# EAGLE design HUD (EAGLE 7.7.0)
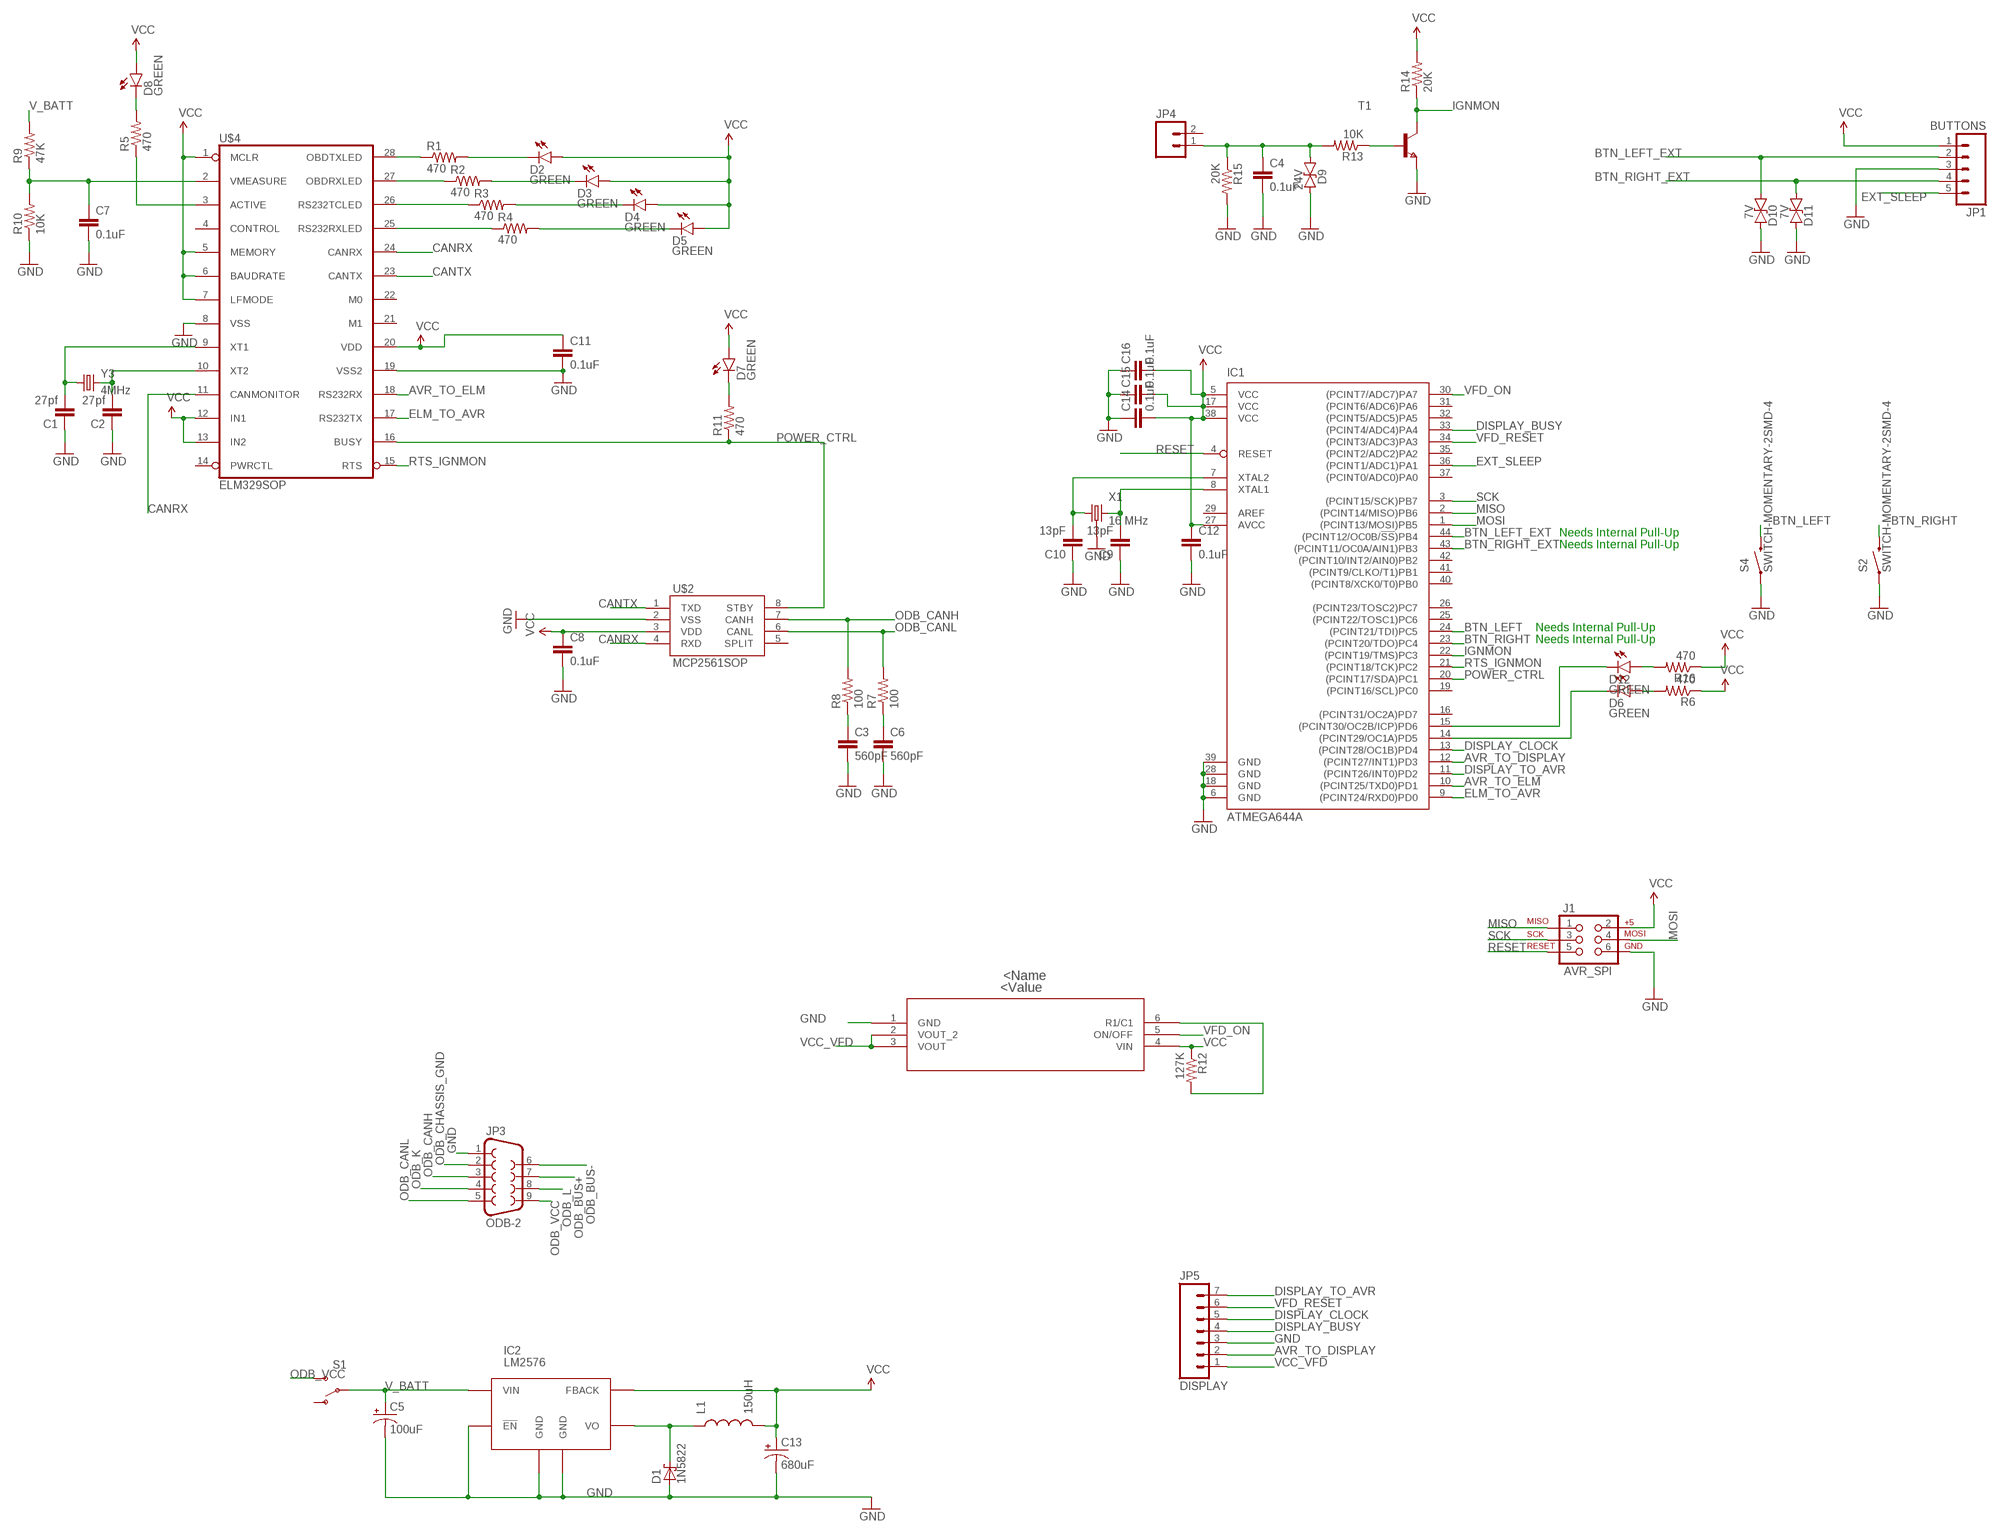
[diagram p0: schematic, sheet 1]

## Parts
C1  27pf  560PF-50V-5%(0603)  [0603-CAP]
C2  27pf  560PF-50V-5%(0603)  [0603-CAP]
C3  560pF  560PF-50V-5%(0603)  [0603-CAP]
C4  0.1uF  560PF-50V-5%(0603)  [0603-CAP]
C5  100uF  CAP_POLPTH1  [CPOL-RADIAL-100UF-25V]
C6  560pF  560PF-50V-5%(0603)  [0603-CAP]
C7  0.1uF  560PF-50V-5%(0603)  [0603-CAP]
C8  0.1uF  560PF-50V-5%(0603)  [0603-CAP]
C9  13pF  560PF-50V-5%(0603)  [0603-CAP]
C10  13pF  560PF-50V-5%(0603)  [0603-CAP]
C11  0.1uF  560PF-50V-5%(0603)  [0603-CAP]
C12  0.1uF  560PF-50V-5%(0603)  [0603-CAP]
C13  680uF  1000UF-25V(PTH)  [CPOL-RADIAL-1000UF-25V]
C14  0.1uF  560PF-50V-5%(0603)  [0603-CAP]
C15  0.1uF  560PF-50V-5%(0603)  [0603-CAP]
C16  0.1uF  560PF-50V-5%(0603)  [0603-CAP]
D1  1N5822  SCHOTTKY-DIODEDO201T15  [DO201T15]
D2  GREEN  LED-GREENLARGE  [LED-1206]
D3  GREEN  LED-GREENLARGE  [LED-1206]
D4  GREEN  LED-GREENLARGE  [LED-1206]
D5  GREEN  LED-GREENLARGE  [LED-1206]
D6  GREEN  LED-GREENLARGE  [LED-1206]
D7  GREEN  LED-GREENLARGE  [LED-1206]
D8  GREEN  LED-GREENLARGE  [LED-1206]
D9  24V  DIODE-TVS16V  [SOD-123]
D10  7V  DIODE-TVS16V  [SOD-123]
D11  7V  DIODE-TVS16V  [SOD-123]
D12  GREEN  LED-GREENLARGE  [LED-1206]
IC1  ATMEGA644A  [TQFP44]
IC2  LM2576  LM2576S  [TO263-5]
J1  AVR_SPI  AVR_SPI_PRG_6PTH  [2X3]
JP1  BUTTONS  M05LOCK  [1X05_LOCK]
JP3  ODB-2  DB9MALE  [DB9_MALE]
JP4  M02LOCK  [1X02_LOCK]
JP5  DISPLAY  M07LOCK  [1X07_LOCK]
L1  150uH  INDUCTORPWR  [CDRH125]
R1  470  RESISTOR0603-RES  [0603-RES]
R2  470  RESISTOR0603-RES  [0603-RES]
R3  470  RESISTOR0603-RES  [0603-RES]
R4  470  RESISTOR0603-RES  [0603-RES]
R5  470  RESISTOR0603-RES  [0603-RES]
R6  470  RESISTOR0603-RES  [0603-RES]
R7  100  RESISTOR0603-RES  [0603-RES]
R8  100  RESISTOR0603-RES  [0603-RES]
R9  47K  RESISTOR0603-RES  [0603-RES]
R10  10K  RESISTOR0603-RES  [0603-RES]
R11  470  RESISTOR0603-RES  [0603-RES]
R12  127K  RESISTOR0603-RES  [0603-RES]
R13  10K  RESISTOR0603-RES  [0603-RES]
R14  20K  RESISTOR0603-RES  [0603-RES]
R15  20K  RESISTOR0603-RES  [0603-RES]
R16  470  RESISTOR0603-RES  [0603-RES]
S1  SWITCH-SPDTPTH  [SWITCH-SPDT]
S2  SWITCH-MOMENTARY-2SMD-4  [TACTILE_SWITCH_TALL]
S4  SWITCH-MOMENTARY-2SMD-4  [TACTILE_SWITCH_TALL]
T1  NPNSOT323  [SOT323]
U$1  TPS27082LDDCRDDC6-M  [DDC6-M]
U$2  MCP2561SOP  [SO08]
U$4  ELM329SOP  [SO28W]
X1  16 MHz  CRYSTAL-GROUNDED3.2X2.5  [CRYSTAL-SMD-3.2X2.5]
Y3  4MHz  CRYSTALHC49US  [HC49US]

## Nets
AVR_TO_DISPLAY: IC1.12((PCINT27/INT1)PD3) JP5.2
AVR_TO_ELM: IC1.10((PCINT25/TXD0)PD1) U$4.18(RS232RX)
BTN_LEFT: IC1.24((PCINT21/TDI)PC5) S4.B2
BTN_LEFT_EXT: D10.A IC1.44((PCINT12/OC0B/!SS!)PB4) JP1.2
BTN_RIGHT: IC1.23((PCINT20/TDO)PC4) S2.B2
BTN_RIGHT_EXT: D11.A IC1.43((PCINT11/OC0A/AIN1)PB3) JP1.4
CANRX: U$2.4(RXD) U$4.11(CANMONITOR) U$4.24(CANRX)
CANTX: U$2.1(TXD) U$4.23(CANTX)
DISPLAY_BUSY: IC1.33((PCINT4/ADC4)PA4) JP5.4
DISPLAY_CLOCK: IC1.13((PCINT28/OC1B)PD4) JP5.5
DISPLAY_TO_AVR: IC1.11((PCINT26/INT0)PD2) JP5.7
ELM_TO_AVR: IC1.9((PCINT24/RXD0)PD0) U$4.17(RS232TX)
EXT_SLEEP: IC1.36((PCINT1/ADC1)PA1) JP1.5
GND [Power]: C1.1 C2.1 C3.2 C4.2 C5.2(-) C6.2 C7.2 C8.2 C9.1 C10.1 C11.2 C12.2 C13.- C14.1 C15.1 C16.1 D1.A D9.C D10.C D11.C IC1.6(GND) IC1.18(GND) IC1.28(GND) IC1.39(GND) IC2.3(GND) IC2.5(!EN) IC2.TAB(GND) J1.6 JP1.3 JP3.1 JP5.3 R10.1 R15.2 S2.A2 S4.A2 T1.3(E) U$1.1(GND) U$2.2(VSS) U$4.8(VSS) U$4.19(VSS2) X1.2 X1.4
IGNMON: IC1.22((PCINT19/TMS)PC3) R14.1 T1.1(C)
MISO: IC1.2((PCINT14/MISO)PB6) J1.1
MOSI: IC1.1((PCINT13/MOSI)PB5) J1.4
N$1 [Power]: R12.2 U$1.6(R1/C1)
N$2: D7.C R11.2
N$3: C4.1 D9.A JP4.1 R13.2 R15.1
N$4: D6.C IC1.14((PCINT29/OC1A)PD5)
N$5: R13.1 T1.2(B)
N$6 [Power]: D1.C IC2.2(VO) L1.1
N$7: R1.1 U$4.28(OBDTXLED)
N$8: D12.A R16.2
N$9: R2.1 U$4.27(OBDRXLED)
N$10: D12.C IC1.15((PCINT30/OC2B/ICP)PD6)
N$11: R3.1 U$4.26(RS232TCLED)
N$14: R4.1 U$4.25(RS232RXLED)
N$15: C1.2 U$4.9(XT1) Y3.1
N$16: C2.2 U$4.10(XT2) Y3.2
N$17: R5.1 U$4.3(ACTIVE)
N$18: D2.C R1.2
N$19: D3.C R2.2
N$20: D4.C R3.2
N$21: D5.C R4.2
N$22: D8.C R5.2
N$26: D6.A R6.2
N$28: C3.1 R8.1
N$29: C6.1 R7.1
N$32: C7.1 R9.1 R10.2 U$4.2(VMEASURE)
N$37: C10.2 IC1.7(XTAL2) X1.3
N$40: C9.2 IC1.8(XTAL1) X1.1
ODB_BUS+: JP3.7
ODB_BUS-: JP3.6
ODB_CANH: JP3.3 R8.2 U$2.7(CANH)
ODB_CANL: JP3.5 R7.2 U$2.6(CANL)
ODB_CHASSIS_GND: JP3.2
ODB_K: JP3.4
ODB_L: JP3.8
ODB_VCC [Power]: JP3.9 S1.3(S)
POWER_CTRL: IC1.20((PCINT17/SDA)PC1) R11.1 U$2.8(STBY) U$4.16(BUSY)
RESET: IC1.4(RESET) J1.5
RTS_IGNMON: IC1.21((PCINT18/TCK)PC2) U$4.15(RTS)
SCK: IC1.3((PCINT15/SCK)PB7) J1.3
V_BATT [Power]: C5.1(+) IC2.1(VIN) R9.2 S1.2(P)
VCC [Power]: C8.1 C11.1 C12.1 C13.+ C14.2 C15.2 C16.2 D2.A D3.A D4.A D5.A D7.A D8.A IC1.5(VCC) IC1.17(VCC) IC1.27(AVCC) IC1.38(VCC) IC2.4(FBACK) J1.2 JP1.1 L1.2 R6.1 R12.1 R14.2 R16.1 U$1.4(VIN) U$2.3(VDD) U$4.1(MCLR) U$4.5(MEMORY) U$4.6(BAUDRATE) U$4.7(LFMODE) U$4.12(IN1) U$4.13(IN2) U$4.20(VDD)
VCC_VFD [Power]: JP5.1 U$1.2(VOUT_2) U$1.3(VOUT)
VFD_ON: IC1.30((PCINT7/ADC7)PA7) U$1.5(ON/OFF)
VFD_RESET: IC1.34((PCINT3/ADC3)PA3) JP5.6
Unconnected: IC1.16((PCINT31/OC2A)PD7) IC1.19((PCINT16/SCL)PC0) IC1.25((PCINT22/TOSC1)PC6) IC1.26((PCINT23/TOSC2)PC7) IC1.29(AREF) IC1.31((PCINT6/ADC6)PA6) IC1.32((PCINT5/ADC5)PA5) IC1.35((PCINT2/ADC2)PA2) IC1.37((PCINT0/ADC0)PA0) IC1.40((PCINT8/XCK0/T0)PB0) IC1.41((PCINT9/CLKO/T1)PB1) IC1.42((PCINT10/INT2/AIN0)PB2) JP4.2 S1.1(O) U$2.5(SPLIT) U$4.4(CONTROL) U$4.14(PWRCTL) U$4.21(M1) U$4.22(M0)

## Notes on the sheet
- Needs Internal Pull-Up
- Needs Internal Pull-Up
- Needs Internal Pull-Up
- Needs Internal Pull-Up

## Library data of the parts
C1 C2 C4 C7-C12 C14-C16 = SparkFun-Capacitors:560PF-50V-5%(0603): CAP-08749; PROD_ID: CAP-08749; VALUE: 560pF
C3 C6 = SparkFun-Capacitors:560PF-50V-5%(0603): CAP-08749; PROD_ID: CAP-08749
C5 = SparkFun-Capacitors:CAP_POL: Capacitor Polarized These are standard SMD and PTH capacitors. Normally 10uF, 47uF, and 100uF in electrolytic and tantalum varieties. Always verify the external diameter of the through hole cap, it varies with capacity, voltage, and manufacturer. The EIA devices should be standard.
C13 = SparkFun-Capacitors:1000UF-25V(PTH): CAP-08070; PROD_ID: CAP-09538; VALUE: CAP-09538
D1 = diode:SCHOTTKY-DIODE: Schottky Diode
D2-D8 D12 = SparkFun-LED:LED-GREEN: Various green LEDs Green LEDs used in SFE Production 0603- DIO-00821 LARGE- DIO-00862 LILYPAD- DIO-09910; PROD_ID: DIO-00862
D9-D11 = analog:DIODE-TVS: Zener Diode Production Part - 8199 3.4V Zener Voltage; PROD_ID: DIO-12440; VALUE: 16V
IC1 = atmel:ATMEGA644: 8-bit Microcontroller with 64K Bytes In-System Programmable Flash Source: http://www.atmel.com/dyn/resources/prod_documents/doc2593.pdf; MPN: ATMEGA644PV-10AU; OC_FARNELL: 1455123; OC_NEWARK: 58M3748
IC2 = AWJLEagleLib:LM2576: Texas Instruments LM2576 Simple Switcher
J1 = SparkFun-Connectors:AVR_SPI_PRG_6: AVR ISP 6 Pin This is the reduced ISP connector for AVR programming. Common on Arduino. This footprint will take up less PCB space and can be used with a 10-pin to 6-pin adapter such as SKU: BOB-08508 **Special note about "TEST_POINT" package. The stop mask is on the top side, so if you want your programming test points to be on the bottom of your board, make sure to place this package on the bottom side of the board. This also ensure that the orientation to program from the bottom side will be correct.
JP1 = SparkFun-Connectors:M05: Header 5 Standard 5-pin 0.1" header. Use with straight break away headers (SKU : PRT-00116), right angle break away headers (PRT-00553), swiss pins (PRT-00743), machine pins (PRT-00117), and female headers (PRT-00115). Molex polarized connector foot print use with SKU : PRT-08230 with associated crimp pins and housings.
JP3 = SparkFun-Connectors:DB9: DB9 Connector Standard DB9 (D-Sub 9) serial connector. Can be used for CAN bus as well as RS485 and RS232. Footprint production proven. Spark Fun Electronics SKU : PRT-00429; PROD_ID: CONN-09904
JP4 = SparkFun-Connectors:M02: Standard 2-pin 0.1" header. Use with - straight break away headers ( PRT-00116) - right angle break away headers (PRT-00553) - swiss pins (PRT-00743) - machine pins (PRT-00117) - female headers (PRT-00115) Molex polarized connector foot print use with: PRT-08233 with associated crimp pins and housings. 2.54_SCREWTERM for use with PRT-10571. 3.5mm Screw Terminal footprints for PRT-08084 5mm Screw Terminal footprints for use with PRT-08432
JP5 = SparkFun-Connectors:M07: Header 7 Standard 7-pin 0.1" header. Use with straight break away headers (SKU : PRT-00116), right angle break away headers (PRT-00553), swiss pins (PRT-00743), machine pins (PRT-00117), and female headers (PRT-00115). NOTES ON THE VARIANTS LOCK and LOCK_LONGPADS... This footprint was designed to help hold the alignment of a through-hole component (i.e. 7-pin header) while soldering it into place. You may notice that each hole has been shifted either up or down by 0.005 of an inch from it's more standard position (which is usually a perfectly straight line). This slight alteration caused the pins (the squares in the middle) to touch the edges of the holes. Because they are alternating, it causes a "brace" to hold the header in place. 0.005 has proven to be the perfect amount of "off-center" position when using our standard breakaway headers. Although looks a little odd when you look at the bare footprint, once you have a header in there, the alteration is very hard to notice. Also, if you push a header all the way into place, it is covered up entirely on the bottom side. This idea of altering the position of holes to aid alignment will be further integrated into the Sparkfun Library for other footprints. It can help hold any component with 3 or more connection pins.
L1 = SparkFun-Passives:INDUCTOR: Inductors Basic Inductor/Choke - 0603 and 1206. Footprints are not proven and vary greatly between part numbers. SRN6045- 33uH, 20% 1.4A SDR0403-560KL - 56uH, 10%, 500mA RMS/740mA peak
R1-R16 = SparkFun-Passives:RESISTOR: Resistor Basic schematic elements and footprints for 0603, 1206, and PTH resistors.
S1 = SparkFun-Electromechanical:SWITCH-SPDT: SPDT Switch Simple slide switch, Spark Fun Electronics SKU : COM-00102 DPDT SMT slide switch, AYZ0202, SWCH-08179; PROD_ID: SWCH-08261
S2 S4 = SparkFun-Electromechanical:SWITCH-MOMENTARY-2: Various NO switches- pushbuttons, reed, etc; PROD_ID: SWCH-11966
T1 = zetex:NPNSOT323: NPN TRANSISTOR; MPN: DSS4160U-7; OC_FARNELL: 1710696; OC_NEWARK: 25R4558
U$1 = power:TPS27082LDDCR; COPYRIGHT: Copyright C 2015 Accelerated Designs. All rights reserved; MANUFACTURER_PART_NUMBER: tps27082lddcr; VENDOR: TEXAS INSTRUMENTS
U$2 = digital:MCP2561
U$4 = ELM327:ELM329
X1 = crystals:CRYSTAL-GROUNDED
Y3 = SparkFun-FreqCtrl:CRYSTAL: Various standard crystals. Proven footprints.

## Net classes
0 default: width 0.254 mm, clearance 0.203 mm
1 Power: width 0.406 mm, clearance 0.203 mm

## Board
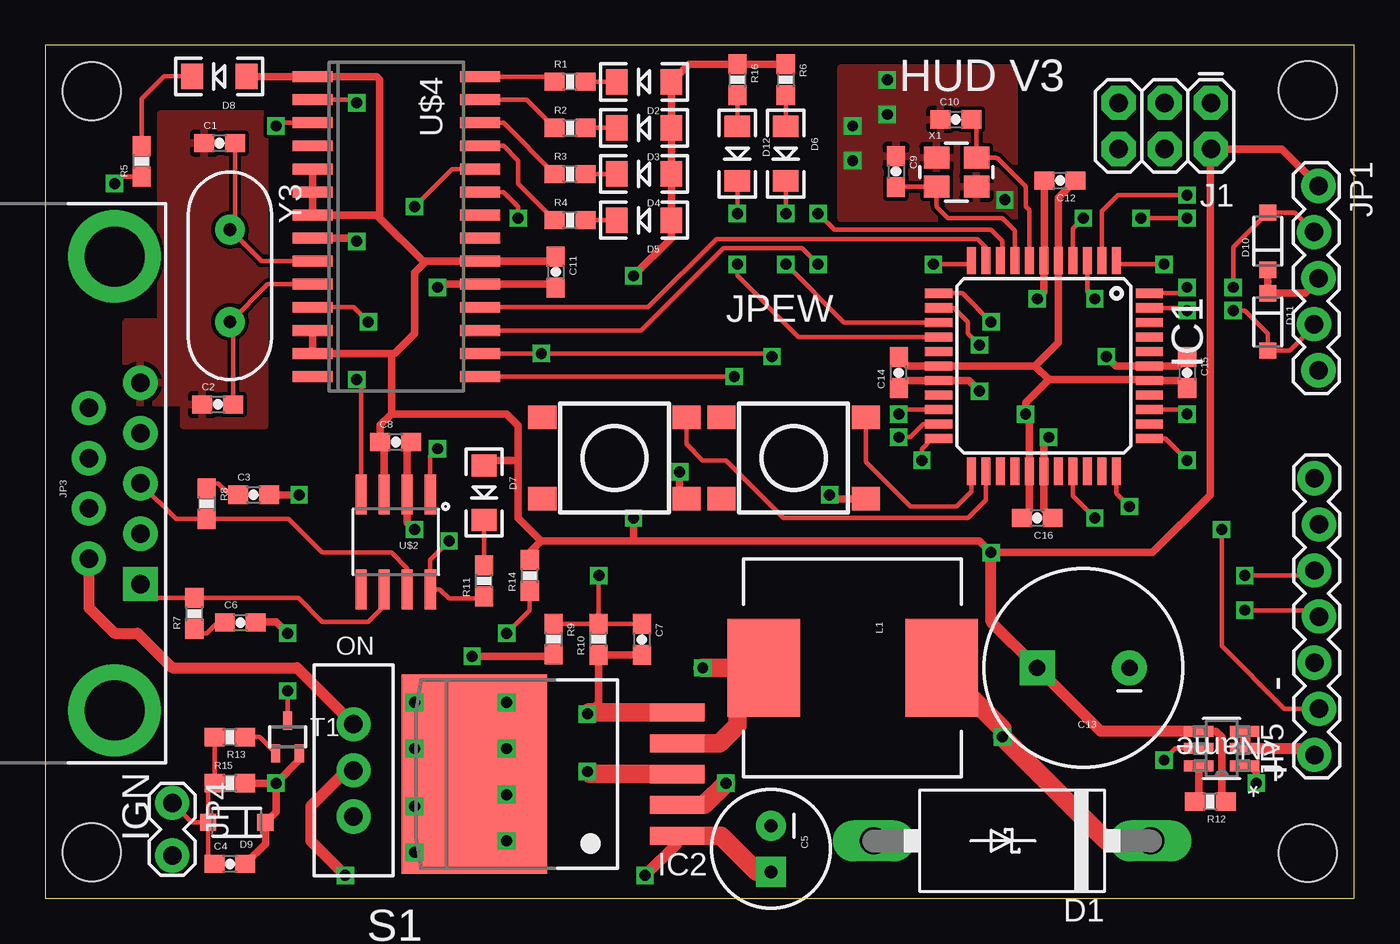
[diagram p1: board, top side]
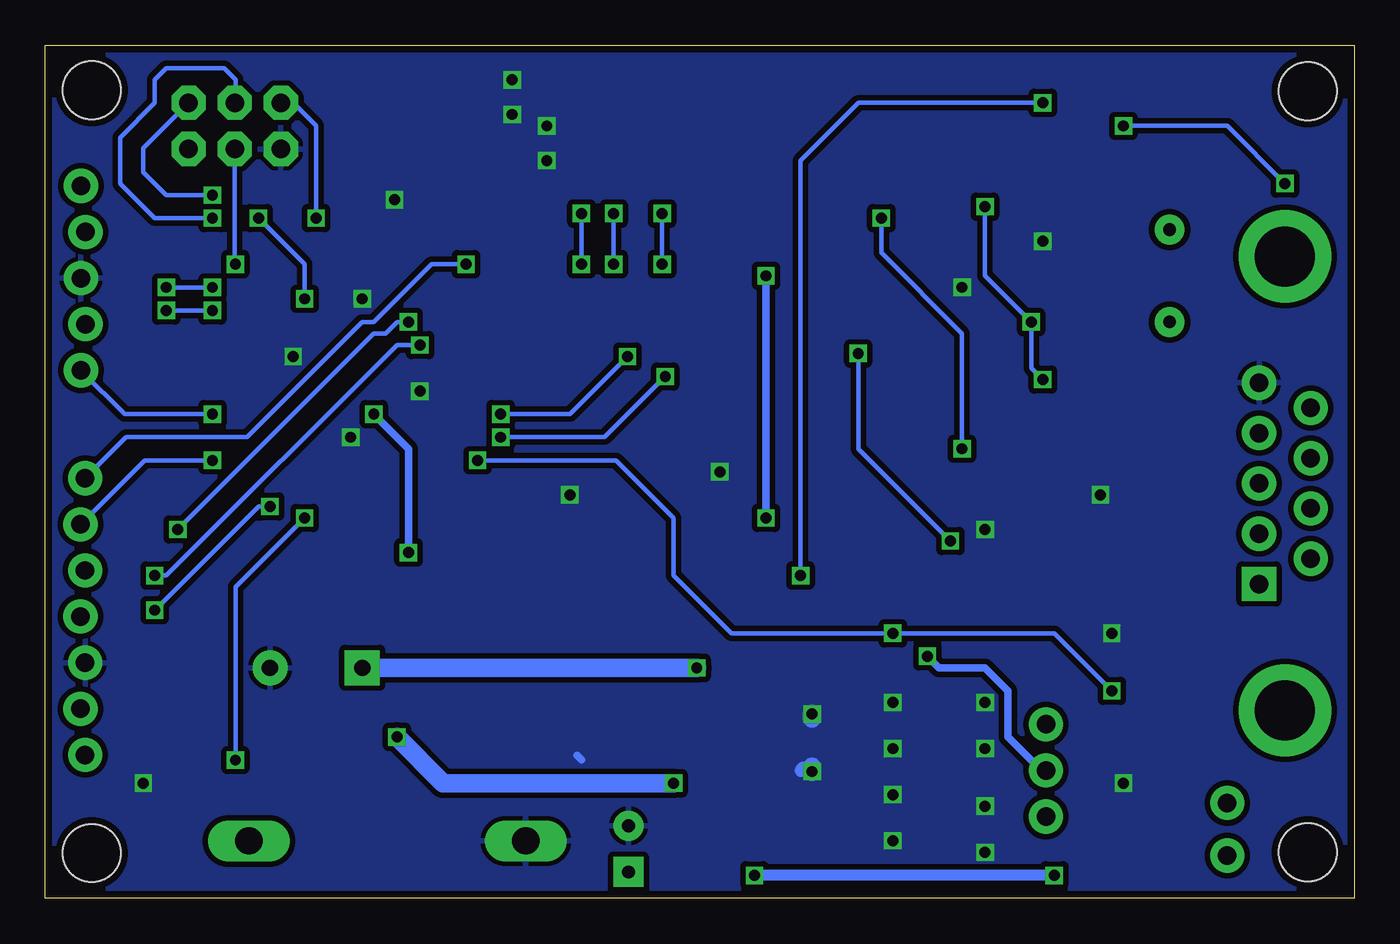
[diagram p2: board, bottom side, seen from below]

Size 72.06 x 46.98 mm. Coordinates in mm from the lower left corner, seen from the top.
Outline: 0,0 72.06,0 72.06,46.98 0,46.98 0,0
Copper layers (1*16): Top 0.0356mm / dielectric 1.5011mm / Bottom 0.0356mm
Design rules "OSHPark": minimum track width 6mil, minimum drill 13mil, track to track 6mil, track to pad 6mil, pad to pad 6mil, via to via 6mil, smd to smd 6mil, copper to edge 15mil, drill to drill 6mil, minimum pad ring 7mil, minimum via ring 7mil, stop-mask expansion 3mil, vias tented up to drill 0mil, thermal gap 10mil
Holes 3.2 mm at 2.54,2.54 2.54,44.45 69.5,2.5 69.5,44.5

### Footprints (pad centres in the part's own frame; a part is rotated, then mirrored left to right if it is on the bottom)
0603-CAP = smd 1.1 x 1: 1 -0.85,0; 2 0.85,0
CPOL-RADIAL-100UF-25V = drill 0.7 pad 1.651 square: 1 1.27,0 | drill 0.7 pad 1.651: 2 -1.27,0
CPOL-RADIAL-1000UF-25V = drill 0.9 pad 1.93 square: + 2.54,0 | drill 0.9 pad 1.93: - -2.54,0
DO201T15 = drill 1.499 long: A 7.62,0; C -7.62,0
LED-1206 = smd 1.2 x 1.4: A -1.5,0; C 1.5,0
SOD-123 = smd 0.9 x 0.95: A 1.575,0; C -1.575,0
TQFP44 = smd 1.5 x 0.5: 1 -5.8,4; 2 -5.8,3.2; 3 -5.8,2.4; 4 -5.8,1.6; 5 -5.8,0.8; 6 -5.8,0; 7 -5.8,-0.8; 8 -5.8,-1.6; 9 -5.8,-2.4; 10 -5.8,-3.2; 11 -5.8,-4; 23 5.8,-4; 24 5.8,-3.2; 25 5.8,-2.4; 26 5.8,-1.6; 27 5.8,-0.8; 28 5.8,0; 29 5.8,0.8; 30 5.8,1.6; 31 5.8,2.4; 32 5.8,3.2; 33 5.8,4 | smd 0.5 x 1.5: 12 -4,-5.8; 13 -3.2,-5.8; 14 -2.4,-5.8; 15 -1.6,-5.8; 16 -0.8,-5.8; 17 0,-5.8; 18 0.8,-5.8; 19 1.6,-5.8; 20 2.4,-5.8; 21 3.2,-5.8; 22 4,-5.8; 34 4,5.8; 35 3.2,5.8; 36 2.4,5.8; 37 1.6,5.8; 38 0.8,5.8; 39 0,5.8; 40 -0.8,5.8; 41 -1.6,5.8; 42 -2.4,5.8; 43 -3.2,5.8; 44 -4,5.8
TO263-5 = smd 1 x 3: 1 -3.4,-8; 2 -1.7,-8; 3 0,-8; 4 1.7,-8; 5 3.4,-8 | smd 11 x 8: TAB 0,3.175
2X3 = drill 1.016 pad 1.88 octagon: 1 0,0; 2 0,2.54; 3 2.54,0; 4 2.54,2.54; 5 5.08,0; 6 5.08,2.54
1X05_LOCK = drill 1.016 pad 1.88: 1 0,0.127; 2 2.54,-0.127; 3 5.08,0.127; 4 7.62,-0.127; 5 10.16,0.127
DB9_MALE = drill 1.016 pad 1.88: 1 5.54,-1.42; 2 2.77,-1.42; 3 0,-1.42; 4 -2.77,-1.42; 6 4.15,1.42; 7 1.38,1.42; 8 -1.38,1.42; 9 -4.15,1.42 | drill 1.016 pad 1.88 square: 5 -5.54,-1.42 | drill 3.302 pad 5.08: G1 -12.5,0; G2 12.5,0
1X02_LOCK = drill 1.016 pad 1.88: 1 -0.178,0; 2 2.718,0
1X07_LOCK = drill 1.016 pad 1.88: 1 0,0.127; 2 2.54,-0.127; 3 5.08,0.127; 4 7.62,-0.127; 5 10.16,0.127; 6 12.7,-0.127; 7 15.24,0.127
CDRH125 = smd 5.4 x 4: 1 0,4.9; 2 0,-4.9
0603-RES = smd 1.1 x 1: 1 -0.85,0; 2 0.85,0
SWITCH-SPDT = drill 1.016 pad 1.88: 1 0,2.54; 2 0,0; 3 0,-2.54
TACTILE_SWITCH_TALL = smd 1.55 x 1.3: A1 -3.975,-2.25; A2 3.975,-2.25; B1 -3.975,2.25; B2 3.975,2.25
SOT323 = smd 0.5 x 1: 1 0,0.9; 2 -0.65,-0.9; 3 0.65,-0.9
DDC6-M = smd 1.626 x 0.61: 1 -1.27,0.95; 2 -1.27,0; 3 -1.27,-0.95; 4 1.27,-0.95; 5 1.27,0; 6 1.27,0.95
SO08 = smd 0.61 x 2.21: 1 -1.905,-2.616; 2 -0.635,-2.616; 3 0.635,-2.616; 4 1.905,-2.616; 5 1.905,2.616; 6 0.635,2.616; 7 -0.635,2.616; 8 -1.905,2.616
SO28W = smd 0.6 x 2.2: 1 -8.255,-4.6; 2 -6.985,-4.6; 3 -5.715,-4.6; 4 -4.445,-4.6; 5 -3.175,-4.6; 6 -1.905,-4.6; 7 -0.635,-4.6; 8 0.635,-4.6; 9 1.905,-4.6; 10 3.175,-4.6; 11 4.445,-4.6; 12 5.715,-4.6; 13 6.985,-4.6; 14 8.255,-4.6; 15 8.255,4.6; 16 6.985,4.6; 17 5.715,4.6; 18 4.445,4.6; 19 3.175,4.6; 20 1.905,4.6; 21 0.635,4.6; 22 -0.635,4.6; 23 -1.905,4.6; 24 -3.175,4.6; 25 -4.445,4.6; 26 -5.715,4.6; 27 -6.985,4.6; 28 -8.255,4.6
CRYSTAL-SMD-3.2X2.5 = smd 1.4 x 1.2: 1 -1.1,-0.8; 2 1.1,-0.8; 3 1.1,0.8; 4 -1.1,0.8
HC49US = drill 0.7 pad 1.651: 1 -2.54,0; 2 2.54,0

### Placement (x,y rotation side)
C1  9.6,41.59 0 top
C2  9.49,27.2 0 top
C3  11.46,22.23 0 top
C4  10.16,1.91 0 top
C5  39.95,2.73 270 top
C6  10.73,15.2 0 top
C7  32.84,14.26 270 top
C8  19.29,25.14 0 top
C9  46.83,40.03 270 top
C10  50.13,42.9 0 top
C11  28.09,34.5 270 top
C12  55.86,39.53 180 top
C13  57.15,12.7 180 top
C14  46.99,28.96 90 top
C15  62.87,28.96 270 top
C16  54.61,20.95 180 top
D1  53.23,3.17 180 top
D2  32.97,44.98 180 top
D3  32.97,42.44 180 top
D4  32.97,39.9 180 top
D5  32.97,37.35 180 top
D6  40.77,41.02 270 top
D7  24.16,22.35 270 top
D8  9.57,45.27 180 top
D9  10.54,4.19 180 top
D10  67.31,36.2 90 top
D11  67.31,31.75 270 top
D12  38.1,41.02 270 top
IC1  54.98,29.32 270 top
IC2  26.8,6.85 90 top
J1  64.17,43.81 180 top
JP1  69.98,39.24 270 top
JP3  3.81,22.86 90 top
JP4  6.99,5.08 270 top
JP5  70,7.91 90 top
L1  44.45,12.7 270 top
R1  28.89,44.98 0 top
R2  28.89,42.44 0 top
R3  28.89,39.9 0 top
R4  28.89,37.35 0 top
R5  5.3,40.59 90 top
R6  40.77,45.09 270 top
R7  8.21,15.69 90 top
R8  8.88,21.74 270 top
R9  27.98,14.28 270 top
R10  30.46,14.28 90 top
R11  24.16,17.48 90 top
R12  64.14,5.33 180 top
R13  10.16,8.89 180 top
R14  26.67,17.78 90 top
R15  10.16,6.35 0 top
R16  38.1,45.09 270 top
S1  16.97,7.05 180 top
S2  41.2,24.26 0 top
S4  31.34,24.26 0 top
T1  13.34,8.89 0 top
U$1  64.77,8.26 180 top
U$2  19.29,19.64 180 top
U$4  19.32,37 270 top
X1  50.16,40.01 0 top
Y3  10.16,34.29 270 top

### Tracks (layer width: path | path; a pad name or v marks a point on that pad's centre or on a via)
AVR_TO_DISPLAY  (via drill 0.6)
  Top 0.254: IC1.12 50.49,33.33 v52.07,31.75 | v64.77,20.32 64.77,13.9 68.22,10.45 JP5.2
  Bottom 0.254: v52.07,31.75 52.7,31.75 53.34,31.11 53.98,31.11 v64.77,20.32
AVR_TO_ELM
  Top 0.254: IC1.10 51.78,35.85 51.31,36.32 36.96,36.32 33.19,32.55 U$4.18
BTN_LEFT
  Top 0.254: S4.B2 35.31,25.02 36.2,24.13 37.47,24.13 40.64,20.95 50.8,20.95 51.78,21.93 IC1.24
BTN_LEFT_EXT  (via drill 0.6)
  Top 0.254: JP1.2 68.78,37.77 D10.A 65.41,35.87 v65.41,33.66 | IC1.44 62.53,33.33 v62.87,33.66
  Bottom 0.254: v62.87,33.66 v65.41,33.66
BTN_RIGHT
  Top 0.254: S2.B2 45.17,24.04 47.62,21.59 50.16,21.59 50.98,22.41 IC1.23 50.95,23.5
BTN_RIGHT_EXT  (via drill 0.6)
  Top 0.254: JP1.4 69.85,31.51 68.52,30.18 D11.A 67.31,31.11 66.04,32.38 v65.41,32.38 | IC1.43 62.73,32.52 v62.87,32.38
  Bottom 0.254: v62.87,32.38 v65.41,32.38
CANRX  (via drill 0.6)
  Top 0.254: U$4.11 16.98,32.55 v17.78,31.75 | v17.14,28.57 17.39,28.34 U$2.4 | U$4.24 22.39,40.17 v20.32,38.1
  Bottom 0.254: v17.14,28.57 17.78,29.21 v17.78,31.75 20.32,34.29 v20.32,38.1
CANTX  (via drill 0.6)
  Top 0.254: U$4.23 25.23,38.91 26.04,38.1 v26.04,37.47 | v21.59,24.77 21.2,24.37 U$2.1
  Bottom 0.254: v26.04,37.47 26.04,35.56 21.59,31.11 v21.59,24.77
DISPLAY_BUSY  (via drill 0.6)
  Top 0.254: IC1.33 58.98,22.3 v59.69,21.59 | v66.04,15.88 69.78,15.88 arc-90 JP5.4
  Bottom 0.254: v59.69,21.59 60.33,21.59 v66.04,15.88
DISPLAY_CLOCK  (via drill 0.6)
  Top 0.254: IC1.13 50.02,32.52 50.8,31.75 50.8,31.11 v51.44,30.48 | v66.04,17.78 69.59,17.78 arc90 JP5.5
  Bottom 0.254: v51.44,30.48 52.7,30.48 65.41,17.78 v66.04,17.78
DISPLAY_TO_AVR  (via drill 0.6)
  Top 0.254: IC1.11 50.78,34.92 v48.9,34.92
  Bottom 0.254: v48.9,34.92 50.8,34.92 53.98,31.75 54.61,31.75 60.96,25.4 67.62,25.4 JP5.7
ELM_TO_AVR  (via drill 0.6)
  Top 0.254: IC1.9 52.7,35.25 52.7,36.2 52.07,36.83 43.43,36.83 v42.55,37.72 | v42.55,34.92 41.66,35.81 37.34,35.81 32.81,31.29 U$4.17
  Bottom 0.254: v42.55,37.72 v42.55,34.92
EXT_SLEEP  (via drill 0.6)
  Top 0.254: v62.87,26.67 62.61,26.93 IC1.36
  Bottom 0.254: JP1.5 67.69,26.67 v62.87,26.67
GND  (via drill 0.6)
  Top 0.406: C12.2 55.01,35.16 IC1.6 54.98,33.39 v54.61,33.02 | C11.2 27.92,33.83 U$4.19 21.76,33.83 v21.59,33.66 | v55.24,25.4 54.98,25.14 IC1.28 54.98,21.43 C16.1 | v51.44,27.94 50.85,28.52 IC1.18 47.41,28.52 C14.1 | v58.42,29.84 58.94,29.32 IC1.39 62.38,29.32 C15.1 | U$4.8 16.98,36.37 v17.14,36.2 | C8.2 19.93,24.92 U$2.2 19.93,20.71 v20.32,20.32 | C3.2 v13.96,22.23 v13.97,22.23 | S4.A2 34.92,22.39 v34.92,23.5 | S2.A2 43.4,22.01 v43.18,22.23 | U$1.1 66.36,7.3 66.67,6.99 v66.67,6.35 | v29.84,10.16 30.46,10.78 R10.1 32.83,13.43 C7.2 | D10.C D11.C 69.38,33.33 70.1,34.05 JP1.3 | C6.2 11.63,15.24 12.7,15.24 v13.34,14.61 | R15.2 v12.7,6.35 | T1.3 13.98,7.63 v12.7,6.35 | v12.7,6.35 12.7,4.78 D9.C 12.12,3.01 C4.2
  Top 0.61: IC2.TAB 25.02,8.26 v25.4,8.26
  Top 1.016: IC2.5 29.93,10.25 v29.84,10.16 | IC2.3 29.98,6.85 v29.84,6.99
  Bottom 0.406: v55.24,25.4 55.37,25.53 | v51.44,27.94 51.56,27.94 | v54.61,33.02 54.48,33.02 54.36,32.89 | v58.42,29.84 58.29,29.97 | v21.59,33.66 21.46,33.53 | v17.14,36.2 17.4,35.94 | 42.55,7.62 42.8,7.87 | v20.32,20.32 20.19,20.19 | v13.97,22.23 14.22,22.23 | v34.92,23.5 34.92,23.62 | v43.18,22.23 42.93,22.23 | v66.67,6.35 66.67,6.1 | v13.34,14.61 13.34,14.35 | v12.7,6.35 12.95,6.35
  Bottom 0.61: 30.48,6.99 30.48,7.11 30.35,7.24
  Bottom 1.016: v29.84,10.16 29.84,9.91 | v29.84,6.99 29.84,7.24
  other vias: 44.45,40.64 46.35,45.09 46.35,43.18 44.45,42.55 20.32,10.79 20.32,8.26 20.32,5.08 20.32,2.54 25.4,3.17 25.4,10.79 25.4,5.71 52.83,38.48
  pour Bottom (isolate 0.305): 0,46.99 72.14,46.99 72.01,0 11.43,-0.08 0,-0.08
  pour Top: 44.45,45.72 53.34,45.72 53.34,37.47 43.81,37.47 43.81,45.72
  pour Top: 6.35,43.18 12.06,43.18 12.06,26.04 7.62,26.04 7.62,27.3 4.45,27.3 4.45,31.75 6.35,31.75
IGNMON  (via drill 0.6)
  Top 0.254: IC1.22 48.82,25.32 48.26,24.77 v48.26,24.13 | R14.1 26.67,15.88 v25.4,14.61 | T1.1 v13.34,11.43
  Bottom 0.254: v48.26,24.13 40.64,24.13 37.47,20.95 37.47,17.78 34.29,14.61 v25.4,14.61 16.51,14.61 v13.34,11.43
MISO  (via drill 0.6)
  Top 0.254: IC1.2 58.18,37.86 59.05,38.73 v62.87,38.73
  Bottom 0.254: J1.1 66.67,41.31 66.67,40.01 65.41,38.73 v62.87,38.73
MOSI  (via drill 0.6)
  Top 0.254: IC1.1 59.18,34.92 v61.59,34.92
  Bottom 0.254: v61.59,34.92 61.63,34.97 J1.4
N$1
  Top 0.406: U$1.6 63.5,5.55 R12.2
N$2
  Top 0.254: D7.C R11.2
N$3
  Top 0.254: 9.22,6.26 R15.1 | 9.22,2 C4.1 8.97,2.25 D9.A | JP4.1 8.05,4.19 D9.A | D9.A 8.97,6.01 R15.1 | R15.1 R13.2
N$4  (via drill 0.6)
  Top 0.254: IC1.14 43.97,31.73 v40.77,34.92 | v40.77,37.72 D6.C
  Bottom 0.254: v40.77,34.92 v40.77,37.72
N$5
  Top 0.254: R13.1 11.79,8.89 T1.2
N$6  (via drill 0.6)
  Top 1.016: IC2.2 36.27,5.15 v37.47,6.35 | L1.1 52.7,9.35 v52.7,8.89 58.42,3.17 D1.C
  Bottom 1.016: v37.47,6.35 50.16,6.35 v52.7,8.89
N$7
  Top 0.254: U$4.28 27.75,45.26 R1.1
N$8
  Top 0.254: D12.A R16.2
N$9
  Top 0.254: U$4.27 26.48,43.98 R2.1
N$10  (via drill 0.6)
  Top 0.254: IC1.15 41.47,30.93 38.1,34.29 v38.1,34.92 | v38.1,37.72 D12.C
  Bottom 0.254: v38.1,34.92 v38.1,37.72
N$11
  Top 0.254: U$4.26 25.21,42.72 R3.1
N$14
  Top 0.254: U$4.25 25.23,41.45 26.04,40.64 26.04,39.35 R4.1
N$15
  Top 0.254: U$4.9 11.89,35.09 Y3.1 10.45,37.12 C1.2
N$16
  Top 0.254: U$4.10 12.23,33.83 Y3.2 10.35,31.57 C2.2
N$17  (via drill 0.6)
  Top 0.254: U$4.3 12.87,42.72 v12.7,42.55 | R5.1 4.18,39.74 v3.81,39.37
  Bottom 0.254: v12.7,42.55 6.99,42.55 v3.81,39.37
N$18
  Top 0.254: R1.2 D2.C
N$19
  Top 0.254: R2.2 D3.C
N$20
  Top 0.254: R3.2 D4.C
N$21
  Top 0.254: R4.2 D5.C
N$22
  Top 0.254: D8.C 6.54,45.27 5.3,44.04 R5.2
N$26
  Top 0.254: D6.A R6.2
N$28
  Top 0.254: C3.1 10.46,22.39 10,22.39 9.53,22.86 9.16,22.86 R8.1
N$29
  Top 0.254: C6.1 9.48,15.2 8.89,14.61 8.44,14.61 R7.1
N$32  (via drill 0.6)
  Top 0.254: v17.14,43.81 16.98,43.98 U$4.2 | R10.2 30.46,17.76 v30.48,17.78 | C7.1 30.47,15.11 R10.2 | R10.2 R9.1
  Bottom 0.254: v30.48,17.78 30.48,40.64 27.3,43.81 v17.14,43.81
N$37
  Top 0.254: IC1.7 54.18,37.9 53.98,38.1 53.98,39.2 52.44,40.73 arc45 52.26,40.8 X1.3 51.27,42.51 arc45 51.19,42.69 C10.2
N$40
  Top 0.254: IC1.8 53.38,36.79 52.7,37.47 49.7,37.47 49.14,38.03 arc-45 49.06,38.21 X1.1 47.02,39.2 arc45 C9.2
ODB_CANH
  Top 0.254: U$2.7 19.93,18.18 19.05,19.05 15.24,19.05 13.4,20.89 R8.2 7.2,20.89 JP3.3
ODB_CANL
  Top 0.254: U$2.6 18.66,16.11 17.78,15.24 15.24,15.24 13.94,16.54 R7.2 6.01,16.54 JP3.5
ODB_VCC
  Top 0.61: JP3.9 2.39,16.02 3.81,14.61 5.08,14.61 6.99,12.7 13.86,12.7 S1.3
POWER_CTRL  (via drill 0.6)
  Top 0.254: v22.23,19.68 21.2,18.66 U$2.8 21.72,17.02 22.23,16.51 24.03,16.51 R11.1 | U$4.16 v27.3,30.02 39.84,30.02 v40.01,29.84 | IC1.20 47.24,26.93 v46.99,26.67
  Bottom 0.254: v22.23,19.68 27.3,24.77 v27.3,30.02 | v40.01,29.84 43.18,26.67 v46.99,26.67
RESET  (via drill 0.6)
  Top 0.254: v57.15,37.47 56.58,36.9 IC1.4
  Bottom 0.254: J1.5 58.42,43.81 57.15,42.55 v57.15,37.47
RTS_IGNMON  (via drill 0.6)
  Top 0.254: U$4.15 v37.93,28.75 | IC1.21 48.35,26.12 47.62,25.4 v46.99,25.4
  Bottom 0.254: v37.93,28.75 41.27,25.4 v46.99,25.4
SCK  (via drill 0.6)
  Top 0.254: IC1.3 57.38,33.42 v57.78,33.02 | v62.87,37.47 v60.33,37.47
  Bottom 0.254: v57.78,33.02 57.78,34.92 v60.33,37.47 | J1.3 61.59,43.85 61.59,45.09 62.23,45.72 65.41,45.72 66.04,45.09 66.04,43.81 67.94,41.91 67.94,39.37 66.04,37.47 v62.87,37.47
V_BATT  (via drill 0.6)
  Top 0.406: v23.5,13.34 27.89,13.34 R9.2
  Top 0.61: IC2.1 34.8,3.04 v33.02,1.27 | S1.2 16.57,7.05 14.61,5.08 14.61,3.17 v16.51,1.27
  Top 1.016: IC2.1 37.19,3.45 39.18,1.46 C5.1
  Bottom 0.406: v23.5,13.34 22.86,12.7 20.32,12.7 19.05,11.43 19.05,8.89 17.21,7.05 S1.2
  Bottom 0.61: v16.51,1.27 v33.02,1.27
VCC  (via drill 0.6)
  Top 0.406: C12.1 55.78,38.6 IC1.5 55.78,30.61 54.49,29.32 | C11.1 27.84,35.09 U$4.20 20.95,35.09 | 54.49,29.32 IC1.17 47.47,29.32 C14.2 | 54.49,29.32 55.24,28.57 | 55.24,28.57 60.73,28.57 IC1.38 62.45,28.52 C15.2 | 55.24,28.57 53.98,27.3 v53.98,26.67 54.18,26.46 IC1.27 54.18,21.38 C16.2 | 20.95,35.09 20.79,35.09 18.41,37.47 | 18.41,37.47 18.25,37.63 U$4.7 U$4.6 U$4.5 | 18.41,37.47 18.41,45.09 18.25,45.26 U$4.1 11.09,45.26 D8.A | 32.38,19.68 27.3,19.68 | U$4.12 U$4.13 19.05,30.02 | 19.05,30.02 19.22,30.02 20.32,31.11 20.32,34.46 20.95,35.09 | v32.38,34.29 34.47,36.37 D5.A D4.A D3.A D2.A 35.42,45.94 R16.1 R6.1 | v32.38,20.95 32.38,19.68 | U$2.3 18.66,24.92 C8.1 18.44,26.06 19.05,26.67 | 19.05,26.67 19.05,30.02 | 19.05,26.67 25.4,26.67 26.04,26.04 26.04,24.13 | 26.04,24.13 26.04,20.95 27.3,19.68 | D7.A 24.43,24.13 26.04,24.13 | 32.38,19.68 51.44,19.68 v52.07,19.05 60.96,19.05 64.14,22.23 64.14,41.23 J1.2 68.07,41.27 JP1.1 | 27.3,19.68 26.67,19.05 R14.2 | U$1.4 64.45,9.21 64.77,8.89 64.77,5.55 R12.1
  Top 0.61: 38.1,11.25 L1.2 | U$1.4 58.1,9.21 C13.+ 52.07,15.24 v52.07,19.05
  Top 1.016: IC2.4 37.12,8.55 38.1,9.53 38.1,11.25 | L1.2 v36.2,12.7
  Bottom 0.406: v32.38,34.29 v32.38,20.95 | v53.98,26.67 52.07,24.77 v52.07,19.05
  Bottom 1.016: v36.2,12.7 C13.+
VCC_VFD
  Top 0.61: U$1.3 U$1.2 69.52,8.26 JP5.1
VFD_ON  (via drill 0.6)
  Top 0.254: IC1.30 56.58,22.16 v57.78,20.95 | v61.59,7.62 62.23,8.26 U$1.5
  Bottom 0.254: v57.78,20.95 61.59,17.14 v61.59,7.62
VFD_RESET  (via drill 0.6)
  Top 0.254: IC1.34 61.67,25.32 v62.87,24.13
  Bottom 0.254: v62.87,24.13 66.6,24.13 JP5.6

### Text on the board
tPlace: HUD V3 | JPEW | ON | - | + | IGN